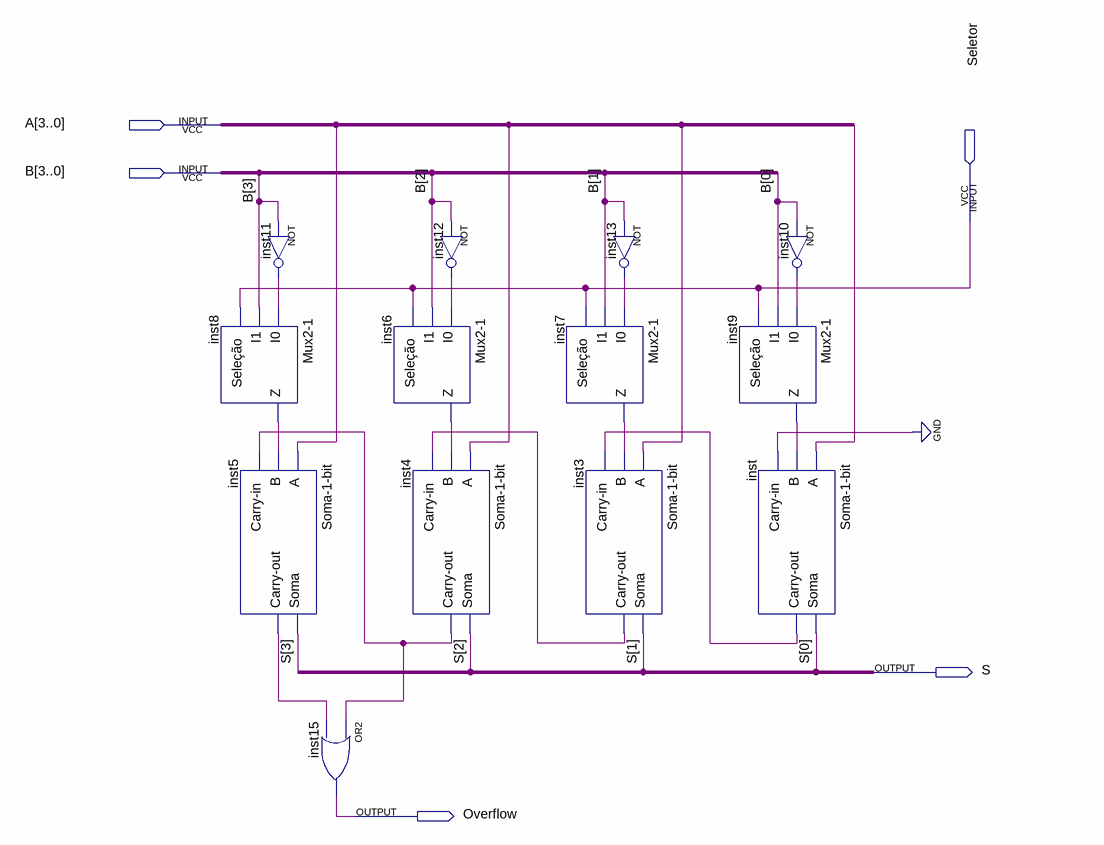
[diagram p0: schematic sheet]
// Quartus schematic Somador-Subtrator-4-bits.bdf as structural Verilog: 13 symbols, 5 pins
module \Somador-Subtrator-4-bits  (
  input  [3:0] A,
  input  [3:0] B,
  input  Seletor,
  output S,
  output Overflow
);

  wire inst3_carry_out, inst4_carry_out, inst5_carry_out, inst6_z, inst7_z, inst8_z, inst9_z, inst10_out,
       inst11_out, inst12_out, inst13_out, inst_carry_out, undriven, undriven_2, undriven_3, undriven_4;
  wire [3:0] S_bus;

  \Mux2-1  inst8 (.I0(inst11_out), .I1(B[3]), .\Seleção (Seletor), .Z(inst8_z));
  \Soma-1-bit  inst5 (
    .A(undriven_4), .B(inst8_z), .\Carry-in (inst4_carry_out), .Soma(S_bus[3]), .\Carry-out (inst5_carry_out));
  not inst11 (inst11_out, B[3]);
  or inst15 (Overflow, inst4_carry_out, inst5_carry_out);
  \Mux2-1  inst6 (.I0(inst12_out), .I1(B[2]), .\Seleção (Seletor), .Z(inst6_z));
  \Soma-1-bit  inst4 (
    .A(undriven_3), .B(inst6_z), .\Carry-in (inst3_carry_out), .Soma(S_bus[2]), .\Carry-out (inst4_carry_out));
  not inst12 (inst12_out, B[2]);
  \Mux2-1  inst7 (.I0(inst13_out), .I1(B[1]), .\Seleção (Seletor), .Z(inst7_z));
  not inst13 (inst13_out, B[1]);
  \Soma-1-bit  inst3 (
    .A(undriven_2), .B(inst7_z), .\Carry-in (inst_carry_out), .Soma(S_bus[1]), .\Carry-out (inst3_carry_out));
  not inst10 (inst10_out, B[0]);
  \Mux2-1  inst9 (.I0(inst10_out), .I1(B[0]), .\Seleção (Seletor), .Z(inst9_z));
  \Soma-1-bit  inst (.A(undriven), .B(inst9_z), .\Carry-in (1'b0), .Soma(S_bus[0]), .\Carry-out (inst_carry_out));
endmodule
